# EAGLE design v15 (EAGLE 9.3.0)

## Sheet 1 of 2: Microcontroller & IO
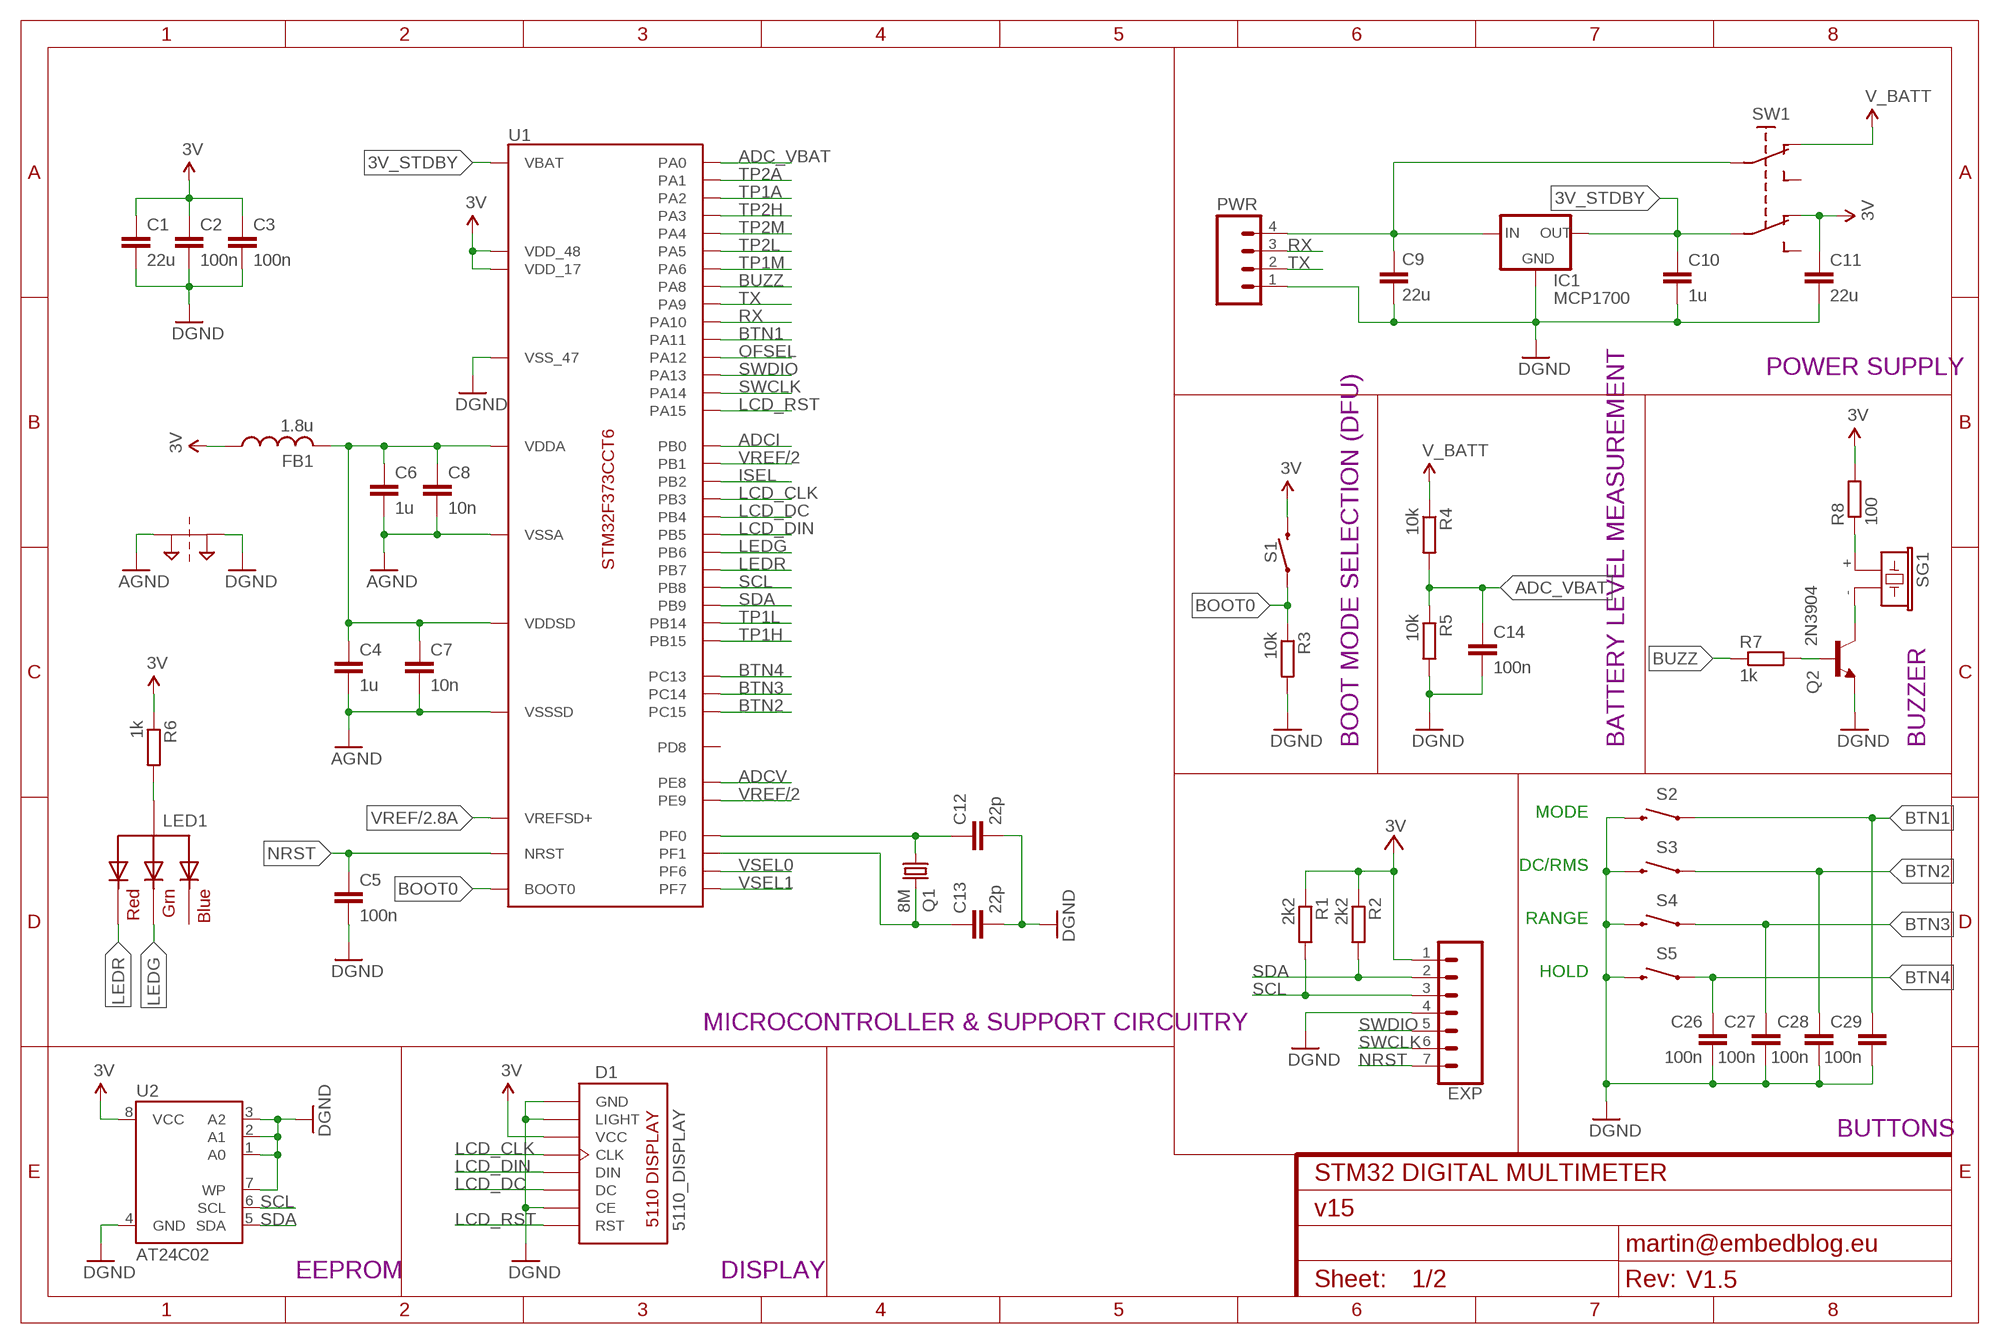
[diagram p0: schematic, sheet 1]
FRAME1 (FRAME-A4L): CNAME: STM32 DIGITAL MULTIMETER; CREVISION: V1.5; DESIGNER: martin@embedblog.eu

### Parts
C1  22u  C-EUC1206  [C1206]
C2  100n  C-EUC1206  [C1206]
C3  100n  C-EUC1206  [C1206]
C4  1u  C-EUC1206  [C1206]
C5  100n  C-EUC1206  [C1206]
C6  1u  C-EUC1206  [C1206]
C7  10n  C-EUC1206  [C1206]
C8  10n  C-EUC1206  [C1206]
C9  22u  C-EUC1206  [C1206]
C10  1u  C-EUC1206  [C1206]
C11  22u  C-EUC1206  [C1206]
C12  22p  C-EUC1206  [C1206]
C13  22p  C-EUC1206  [C1206]
C14  100n  C-EUC1206  [C1206]
C26  100n  C-EUC1206  [C1206]
C27  100n  C-EUC1206  [C1206]
C28  100n  C-EUC1206  [C1206]
C29  100n  C-EUC1206  [C1206]
D1  5110_DISPLAY  [5110_LAYOUT]
EXP  CONN_07  [1X07]
FB1  1.8u  FERRITE-BEADC  [1206]
IC1  MCP1700  XC63FPM  [SOT23]
LED1  RGBLED_CA-5MM  [LED5MMRGB]
PT1  2PT_GND_TIE  [2PT_GND_TIE]
PWR  M04PTH  [1X04@1]
Q1  8M  CRYSTALHC49U-V  [HC49U-V]
Q2  2N3904  2N3904-MMBT  [SOT23]
R1  2k2  R-EU_R1206  [R1206]
R2  2k2  R-EU_R1206  [R1206]
R3  10k  R-EU_R1206  [R1206]
R4  10k  R-EU_R1206  [R1206]
R5  10k  R-EU_R1206  [R1206]
R6  1k  R-EU_R1206  [R1206]
R7  1k  R-EU_R1206  [R1206]
R8  100  R-EU_R1206  [R1206]
S1  MOMENTARY-SWITCH-SPST-PTH-6.0MM  [TACTILE_SWITCH_PTH_6.0MM]
S2  MOMENTARY-SWITCH-SPST-SMD-12MM  [TACTILE_SWITCH_SMD_12MM]
S3  MOMENTARY-SWITCH-SPST-SMD-12MM  [TACTILE_SWITCH_SMD_12MM]
S4  MOMENTARY-SWITCH-SPST-SMD-12MM  [TACTILE_SWITCH_SMD_12MM]
S5  MOMENTARY-SWITCH-SPST-SMD-12MM  [TACTILE_SWITCH_SMD_12MM]
SG1  F/CM12P  [F/CM12P]
SW1  DPDT_SWITCH_SMALL  [DPDT_SMALL]
U1  STM32F373CCT6  [LQFP-48]
U2  AT24C02  24LCXX  [SOIC8]

### Nets
3V: C1.1 C2.1 C3.1 C11.1 D1.VCC EXP.1 FB1.1 R1.1 R2.1 R6.1 R8.2 S1.3 SW1.P$6(NC2) U1.17(VDD_17) U1.48(VDD_48) U2.8(VCC) ; also sheet 2
3V_STDBY: C10.1 IC1.2(OUT) SW1.P$5(I2) U1.1(VBAT)
ADC_VBAT: C14.1 R4.2 R5.1 U1.10(PA0)
ADCI: U1.18(PB0) ; also sheet 2
ADCV: U1.21(PE8) ; also sheet 2
AGND: C4.2 C6.2 C7.2 C8.2 PT1.P$1 U1.8(VSSA) U1.23(VSSSD) ; also sheet 2
BOOT0: R3.1 S1.1 U1.44(BOOT0)
BTN1: C29.1 S2.1 U1.32(PA11)
BTN2: C28.1 S3.1 U1.4(PC15)
BTN3: C27.1 S4.1 U1.3(PC14)
BTN4: C26.1 S5.1 U1.2(PC13)
BUZZ: R7.1 U1.29(PA8)
GND: C1.2 C2.2 C3.2 C5.2 C9.2 C10.2 C11.2 C12.2 C13.2 C14.2 C26.2 C27.2 C28.2 C29.2 D1.CE D1.GND D1.LIGHT EXP.4 IC1.1(GND) PT1.P$2 PWR.1 Q2.2(E) R3.2 R5.2 S2.3 S3.3 S4.3 S5.3 U1.47(VSS_47) U2.1(A0) U2.2(A1) U2.3(A2) U2.4(GND) U2.7(WP) ; supply symbol labelled DGND
ISEL: U1.20(PB2) ; also sheet 2
LCD_CLK: D1.CLK U1.39(PB3)
LCD_DC: D1.DC U1.40(PB4)
LCD_DIN: D1.DIN U1.41(PB5)
LCD_RST: D1.RST U1.38(PA15)
LEDG: LED1.3(GREEN) U1.42(PB6)
LEDR: LED1.1(RED) U1.43(PB7)
N$2: C12.1 Q1.1 U1.5(PF0)
N$8: C4.1 C6.1 C7.1 C8.1 FB1.2 U1.9(VDDA) U1.24(VDDSD)
N$14: C9.1 IC1.3(IN) PWR.4 SW1.P$2(I1)
N$15: LED1.2(VCC) R6.2
N$19: R8.1 SG1.+
N$21: C13.1 Q1.2 U1.6(PF1)
N$36: Q2.3(C) SG1.-
N$37: Q2.1(B) R7.2
NRST: C5.1 EXP.7 U1.7(NRST)
OFSEL: U1.33(PA12) ; also sheet 2
RX: PWR.3 U1.31(PA10)
SCL: EXP.3 R1.2 U1.45(PB8) U2.6(SCL)
SDA: EXP.2 R2.2 U1.46(PB9) U2.5(SDA)
SWCLK: EXP.6 U1.37(PA14)
SWDIO: EXP.5 U1.34(PA13)
TP1A: U1.12(PA2) ; also sheet 2
TP1H: U1.27(PB15) ; also sheet 2
TP1L: U1.26(PB14) ; also sheet 2
TP1M: U1.16(PA6) ; also sheet 2
TP2A: U1.11(PA1) ; also sheet 2
TP2H: U1.13(PA3) ; also sheet 2
TP2L: U1.15(PA5) ; also sheet 2
TP2M: U1.14(PA4) ; also sheet 2
TX: PWR.2 U1.30(PA9)
V_BATT: R4.1 SW1.P$1(NC1)
VREF: U1.25(VREFSD+) ; also sheet 2
VREF/2: U1.19(PB1) U1.22(PE9) ; also sheet 2
VSEL0: U1.35(PF6) ; also sheet 2
VSEL1: U1.36(PF7) ; also sheet 2
Unconnected: LED1.4(BLUE) SW1.P$3(NO1) SW1.P$4(NO2) U1.28(PD8)

### Notes on the sheet
- POWER SUPPLY
- BOOT MODE SELECTION (DFU) | BATTERY LEVEL MEASUREMENT | BUZZER
- MODE
- DC/RMS
- RANGE
- HOLD
- MICROCONTROLLER & SUPPORT CIRCUITRY
- BUTTONS
- EEPROM | DISPLAY

## Sheet 2 of 2: Analog Front End
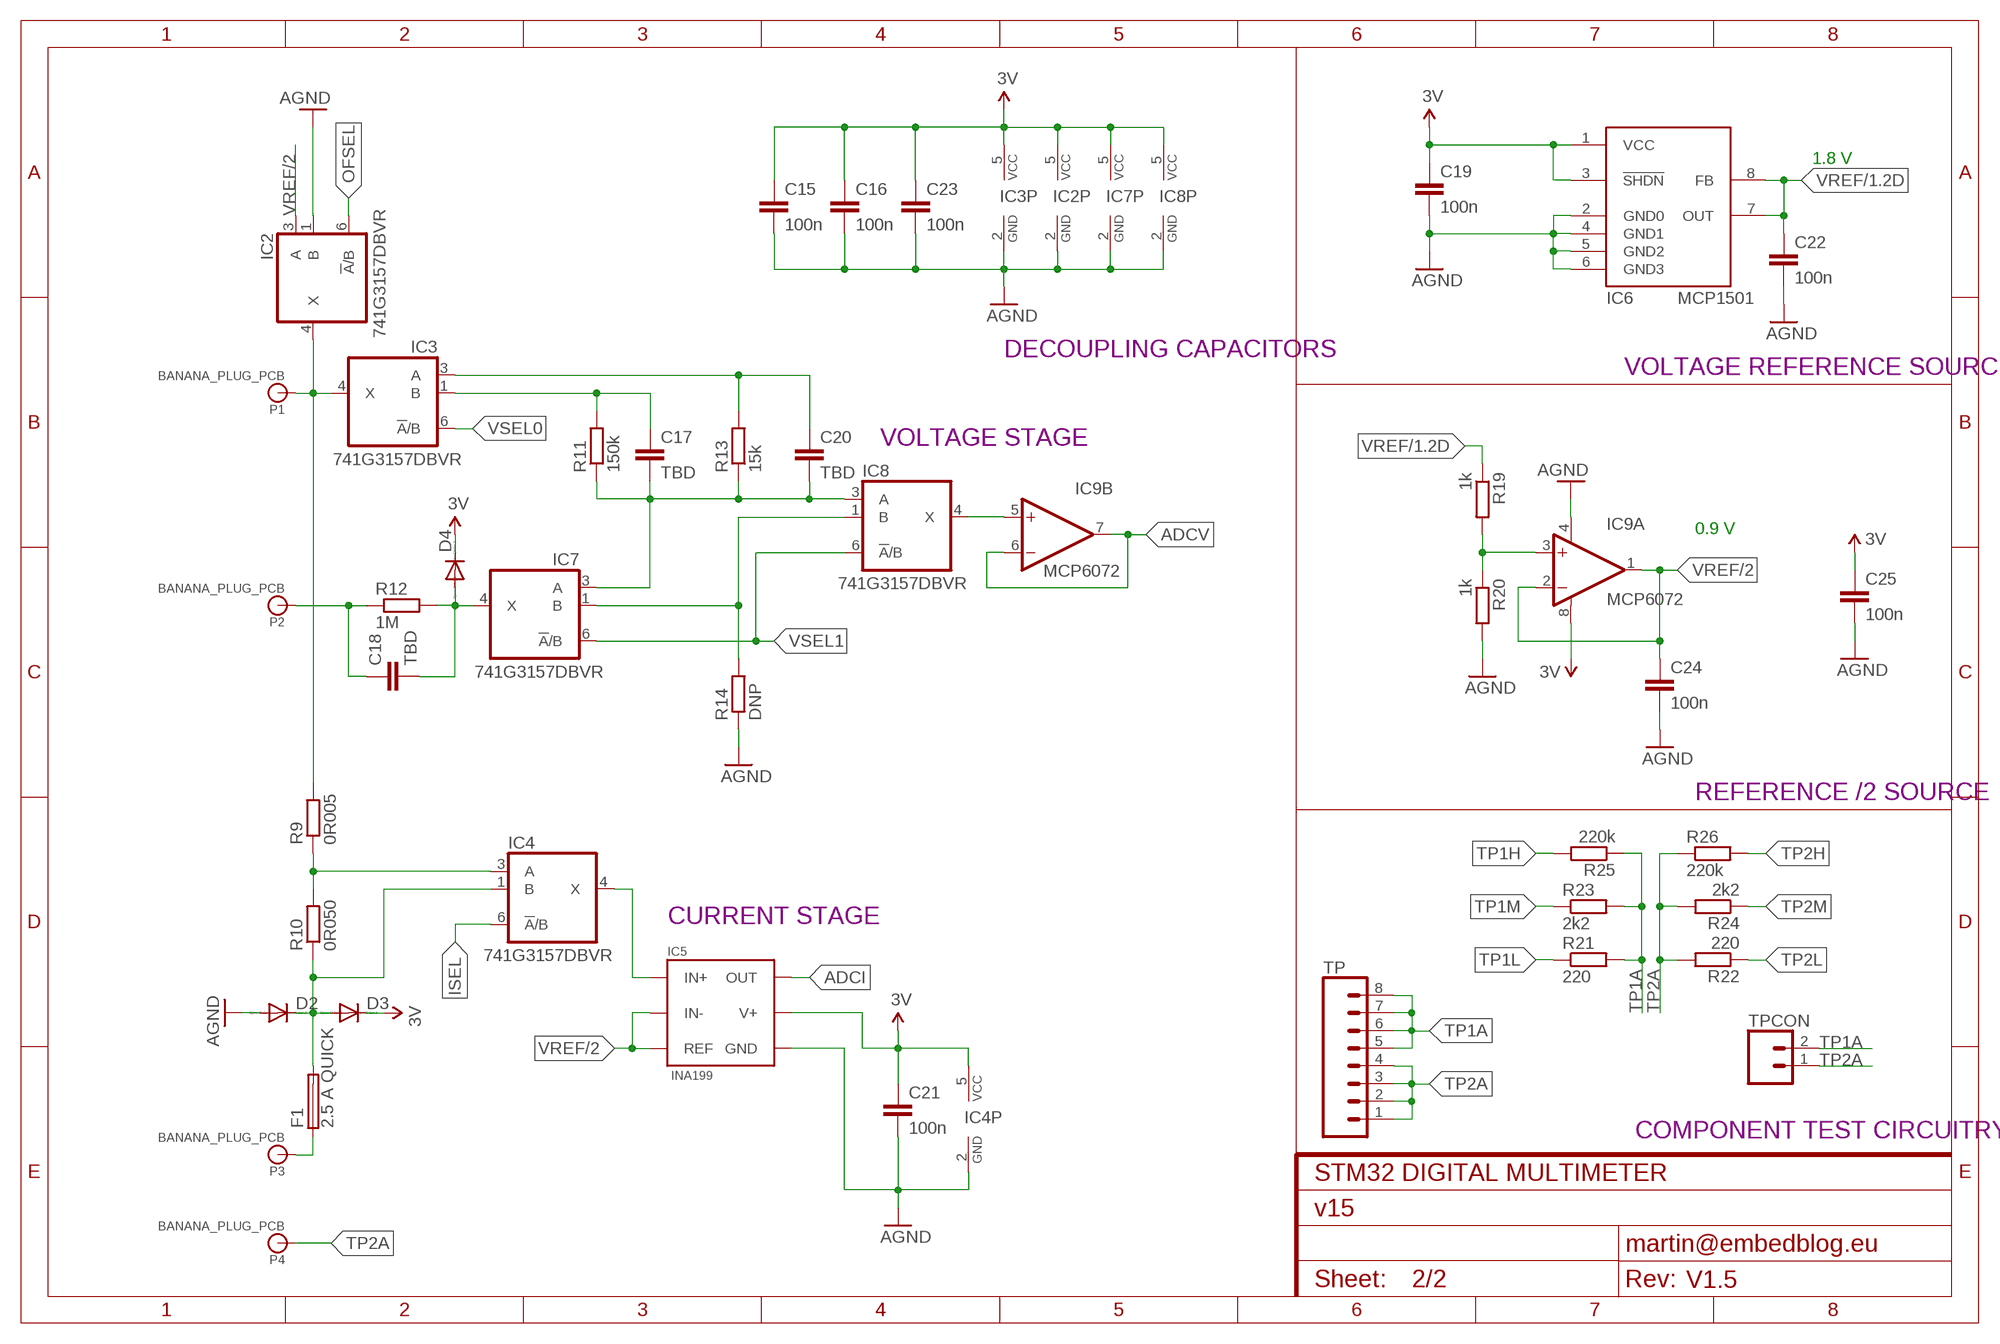
[diagram p1: schematic, sheet 2]
FRAME2 (FRAME-A4L): CNAME: STM32 DIGITAL MULTIMETER; CREVISION: V1.5; DESIGNER: martin@embedblog.eu

### Parts
C15  100n  CAP1206  [1206]
C16  100n  CAP1206  [1206]
C17  TBD  CAP1206  [1206]
C18  TBD  CAP1206  [1206]
C19  100n  C-EUC1206  [C1206]
C20  TBD  CAP1206  [1206]
C21  100n  CAP1206  [1206]
C22  100n  C-EUC1206  [C1206]
C23  100n  CAP1206  [1206]
C24  100n  C-EUC1206  [C1206]
C25  100n  C-EUC1206  [C1206]
D2  DIODE-MINIMELF  [MINIMELF]
D3  DIODE-MINIMELF  [MINIMELF]
D4  DIODE-MINIMELF  [MINIMELF]
F1  2.5 A QUICK  FUSESHK20L  [SHK20L]
IC2  741G3157DBVR  [DBV_R-PDSO-G6]
IC3  741G3157DBVR  [DBV_R-PDSO-G6]
IC4  741G3157DBVR  [DBV_R-PDSO-G6]
IC5  INA199  [SC70-6]
IC6  MCP1501  [SO08]
IC7  741G3157DBVR  [DBV_R-PDSO-G6]
IC8  741G3157DBVR  [DBV_R-PDSO-G6]
IC9  MCP6072  OPAMP-DUALU  [SO08]
P1  BANANA_PLUG_PCB  [BANANA_6MMHOLE]
P2  BANANA_PLUG_PCB  [BANANA_6MMHOLE]
P3  BANANA_PLUG_PCB  [BANANA_6MMHOLE]
P4  BANANA_PLUG_PCB  [BANANA_6MMHOLE]
R9  0R005  R-EU_R1206  [R1206]
R10  0R050  R-EU_R1206  [R1206]
R11  150k  R-EU_R1206  [R1206]
R12  1M  R-EU_R1206  [R1206]
R13  15k  R-EU_R1206  [R1206]
R14  DNP  R-EU_R1206  [R1206]
R19  1k  R-EU_R1206  [R1206]
R20  1k  R-EU_R1206  [R1206]
R21  220  R-EU_R1206  [R1206]
R22  220  R-EU_R1206  [R1206]
R23  2k2  R-EU_R1206  [R1206]
R24  2k2  R-EU_R1206  [R1206]
R25  220k  R-EU_R1206  [R1206]
R26  220k  R-EU_R1206  [R1206]
TP  CONN_08SMD-STRAIGHT-FEMALE  [1X08_SMD]
TPCON  CONN_02  [1X02]

### Nets
3V: C15.1 C16.1 C19.1 C21.1 C23.1 C25.1 D3.C D4.C IC2.5(VCC) IC3.5(VCC) IC4.5(VCC) IC5.3(V+) IC6.1(VCC) IC6.3(!SHDN) IC7.5(VCC) IC8.5(VCC) IC9.8(A:V+) ; also sheet 1
ADCI: IC5.6(OUT) ; also sheet 1
ADCV: IC9.6(B:-IN) IC9.7(B:OUT) ; also sheet 1
AGND: C15.2 C16.2 C19.2 C21.2 C22.2 C23.2 C24.2 C25.2 D2.A IC2.1(B) IC2.2(GND) IC3.2(GND) IC4.2(GND) IC5.2(GND) IC6.2(GND0) IC6.4(GND1) IC6.5(GND2) IC6.6(GND3) IC7.2(GND) IC8.2(GND) IC9.4(A:V-) R14.1 R20.2 ; also sheet 1
COM: IC2.4(X) IC3.4(X) P1.P$1 R9.2
ISEL: IC4.6(!A!/B) ; also sheet 1
N$1: C18.1 P2.P$1 R12.1
N$3: C17.1 IC3.1(B) R11.2
N$4: C20.1 IC3.3(A) R13.2
N$5: C18.2 D4.A IC7.4(X) R12.2
N$7: IC4.3(A) R9.1 R10.2
N$9: C17.2 C20.2 IC7.3(A) IC8.3(A) R11.1 R13.1
N$10: D2.C D3.A F1.2A IC4.1(B) R10.1
N$12: IC8.4(X) IC9.5(B:+IN)
N$13: IC7.1(B) IC8.1(B) R14.2
N$17: IC9.3(A:+IN) R19.2 R20.1
N$18: IC4.4(X) IC5.4(IN+)
N$22: F1.1A P3.P$1
OFSEL: IC2.6(!A!/B) ; also sheet 1
TP1A: R21.2 R23.2 R25.1 TP.5 TP.6 TP.7 TP.8 TPCON.2 ; also sheet 1
TP1H: R25.2 ; also sheet 1
TP1L: R21.1 ; also sheet 1
TP1M: R23.1 ; also sheet 1
TP2A: P4.P$1 R22.2 R24.2 R26.1 TP.1 TP.2 TP.3 TP.4 TPCON.1 ; also sheet 1
TP2H: R26.2 ; also sheet 1
TP2L: R22.1 ; also sheet 1
TP2M: R24.1 ; also sheet 1
VREF: C22.1 IC6.7(OUT) IC6.8(FB) R19.1 ; also sheet 1
VREF/2: C24.1 IC2.3(A) IC5.1(REF) IC5.5(IN-) IC9.1(A:OUT) IC9.2(A:-IN) ; also sheet 1
VSEL0: IC3.6(!A!/B) ; also sheet 1
VSEL1: IC7.6(!A!/B) IC8.6(!A!/B) ; also sheet 1

### Notes on the sheet
- 1.8 V
- DECOUPLING CAPACITORS
- VOLTAGE REFERENCE SOURCE
- VOLTAGE STAGE
- 0.9 V
- REFERENCE /2 SOURCE
- CURRENT STAGE
- COMPONENT TEST CIRCUITRY

## Library data of the parts
C1-C14 C19 C22 C24-C29 = resistor:C-EU: CAPACITOR, European symbol
C15-C18 C20 C21 C23 = SparkFun-Passives:CAP: Capacitor Standard 0603 ceramic capacitor, and 0.1" leaded capacitor.
D1 = custom:5110_DISPLAY
D2-D4 = diode:DIODE-: DIODE
EXP = SparkFun-Connectors:CONN_07: Multi connection point. Often used as Generic Header-pin footprint for 0.1 inch spaced/style header connections On any of the 0.1 inch spaced packages, you can populate with these: Break Away Headers - Straight <https://www.sparkfun.com/products/116> (PRT-00116) Break Away Male Headers - Right Angle <https://www.sparkfun.com/products/553> (PRT-00553) Female Headers <https://www.sparkfun.com/products/115> (PRT-00115) Break Away Headers - Machine Pin <https://www.sparkfun.com/products/117> (PRT-00117) Break Away Female Headers - Swiss Machine Pin <https://www.sparkfun.com/products/743> (PRT-00743) For SCREWTERMINALS and SPRING TERMINALS visit here: Screw Terimnals on SparkFun.com <https://www.sparkfun.com/search/results?term=Screw+Terminals> (5mm/3.5mm/2.54mm spacing) This device is also useful as a general connection point to wire up your design to another part of your project. Our various solder wires solder well into these plated through hole pads. Hook-Up Wire - Assortment (Stranded, 22 AWG) <https://www.sparkfun.com/products/11375> (PRT-11375) Hook-Up Wire - Assortment (Solid Core, 22 AWG) <https://www.sparkfun.com/products/11367> (PRT-11367) View the entire wire category on our website here <https://www.sparkfun.com/categories/141> Special notes: Molex polarized connector foot print use with SKU : PRT-08231 with associated crimp pins and housings. 1MM SMD Version SKU: PRT-10208 NOTES ON THE VARIANTS LOCK and LOCK_LONGPADS... This footprint was designed to help hold the alignment of a through-hole component (i.e. 6-pin header) while soldering it into place. You may notice that each hole has been shifted either up or down by 0.005 of an inch from it's more standard position (which is a perfectly straight line). This slight alteration caused the pins (the squares in the middle) to touch the edges of the holes. Because they are alternating, it causes a "brace" to hold the component in place. 0.005 has proven to be the perfect amount of "off-center" position when using our standard breakaway headers. Although looks a little odd when you look at the bare footprint, once you have a header in there, the alteration is very hard to notice. Also,if you push a header all the way into place, it is covered up entirely on the bottom side.
F1 = fuse:FUSE: Fuse; OC_FARNELL: unknown; OC_NEWARK: unknown
FB1 = m-pad-2.1:FERRITE-BEAD: Ferrite beads in various packages
IC1 = v-reg:XC63FP: Positiv Voltage Regulators www.torex.co.jp/english/product/pro02/pdf/0201_xc62fp.pdf
IC2-IC4 IC7 IC8 = 74xx-little-de:74*1G3157: Single-Pole, Double-Throw Analog Switch Source: http://focus.ti.com/lit/ds/symlink/sn74lvc1g3157.pdf
IC5 = custom:INA199
IC6 = custom:MCP1501
IC9 = SparkFun-AnalogIC:OPAMP-DUAL: Generic op-amp footprint
LED1 = adafruit:RGBLED_CA: RGB LED, common-anode 5MM Staggered pins 5mm Piranha package http://www.ladyada.net/library/pcb/eaglelibrary.html
P1-P4 = custom:BANANA_PLUG_PCB
PT1 = SparkFun-Passives:2PT_GND_TIE: Package for connecting two ground nets in one place.
PWR = SparkFun-Connectors:M04: Header 4 Standard 4-pin 0.1" header. Use with straight break away headers (SKU : PRT-00116), right angle break away headers (PRT-00553), swiss pins (PRT-00743), machine pins (PRT-00117), and female headers (PRT-00115). Molex polarized connector foot print use with SKU : PRT-08231 with associated crimp pins and housings. 1MM SMD Version SKU: PRT-10208; PROD_ID: CONN-09696
Q1 = crystal:CRYSTAL: CRYSTAL; OC_FARNELL: 1666969; OC_NEWARK: unknown
Q2 = m-pad-2.1:2N3904: NPN TRANSISTOR
R1-R14 R19-R26 = resistor:R-EU_: RESISTOR, European symbol
S1 = SparkFun-Switches:MOMENTARY-SWITCH-SPST: Momentary Switch (Pushbutton) - SPST Normally-open (NO) SPST momentary switches (buttons, pushbuttons). Variants PTH-12MM - 12mm square, through-hole Momentary Pushbutton Switch - 12mm Square <https://www.sparkfun.com/products/9190> (COM-09190) PTH-6.0MM, PTH-6.0MM-KIT - 6.0mm square, through-hole Mini Pushbutton Switch <https://www.sparkfun.com/products/97> (COM-00097) KIT package intended for soldering kit's - only one side of pads' copper is exposed. PTH-RIGHT-ANGLE-KIT - Right-angle, through-hole Right Angle Tactile Button <https://www.sparkfun.com/products/10791> - Used on SparkFun BigTime Watch Kit <https://www.sparkfun.com/products/11734> SMD-12MM - 12mm square, surface-mount Tactile Button - SMD (12mm) <https://www.sparkfun.com/products/12993> (COM-12993) Used on SparkFun PicoBoard <https://www.sparkfun.com/products/11888> SMD-4.5MM - 4.5mm Square Trackball Switch Used on SparkFun Blackberry Trackballer Breakout <https://www.sparkfun.com/products/13169> SMD-4.6MMX2.8MM - 4.60mm x 2.80mm, surface mount Used on SparkFun SAMD21 Mini Breakout <https://www.sparkfun.com/products/13664> SMD-5.2MM, SMD-5.2-REDUNDANT - 5.2mm square, surface-mount Mini Pushbutton Switch - SMD <https://www.sparkfun.com/products/8720> (COM-08720) Used on Arduino Pro Mini <https://www.sparkfun.com/products/11114> REDUNDANT package connects both switch circuits together SMD-6.0X3.5MM - 6.0 x 3.5mm, surface mount Momentary Reset Switch SMD <https://www.sparkfun.com/products/8229> (COM-08229) SMD-6.2MM-TALL - 6.2mm square, surface mount Tactile Button - SMD (6mm) <https://www.sparkfun.com/products/12992> Used on SparkFun Digital Sandbox <https://www.sparkfun.com/products/12651> SMD-RIGHT-ANGLE - Right-angle, surface mount Used on SparkFun Block for Intel® Edison - Arduino <https://www.sparkfun.com/products/13036>; PROD_ID: SWCH-08441; SF_SKU: COM-00097
S2-S5 = SparkFun-Switches:MOMENTARY-SWITCH-SPST: Momentary Switch (Pushbutton) - SPST Normally-open (NO) SPST momentary switches (buttons, pushbuttons). Variants PTH-12MM - 12mm square, through-hole Momentary Pushbutton Switch - 12mm Square <https://www.sparkfun.com/products/9190> (COM-09190) PTH-6.0MM, PTH-6.0MM-KIT - 6.0mm square, through-hole Mini Pushbutton Switch <https://www.sparkfun.com/products/97> (COM-00097) KIT package intended for soldering kit's - only one side of pads' copper is exposed. PTH-RIGHT-ANGLE-KIT - Right-angle, through-hole Right Angle Tactile Button <https://www.sparkfun.com/products/10791> - Used on SparkFun BigTime Watch Kit <https://www.sparkfun.com/products/11734> SMD-12MM - 12mm square, surface-mount Tactile Button - SMD (12mm) <https://www.sparkfun.com/products/12993> (COM-12993) Used on SparkFun PicoBoard <https://www.sparkfun.com/products/11888> SMD-4.5MM - 4.5mm Square Trackball Switch Used on SparkFun Blackberry Trackballer Breakout <https://www.sparkfun.com/products/13169> SMD-4.6MMX2.8MM - 4.60mm x 2.80mm, surface mount Used on SparkFun SAMD21 Mini Breakout <https://www.sparkfun.com/products/13664> SMD-5.2MM, SMD-5.2-REDUNDANT - 5.2mm square, surface-mount Mini Pushbutton Switch - SMD <https://www.sparkfun.com/products/8720> (COM-08720) Used on Arduino Pro Mini <https://www.sparkfun.com/products/11114> REDUNDANT package connects both switch circuits together SMD-6.0X3.5MM - 6.0 x 3.5mm, surface mount Momentary Reset Switch SMD <https://www.sparkfun.com/products/8229> (COM-08229) SMD-6.2MM-TALL - 6.2mm square, surface mount Tactile Button - SMD (6mm) <https://www.sparkfun.com/products/12992> Used on SparkFun Digital Sandbox <https://www.sparkfun.com/products/12651> SMD-RIGHT-ANGLE - Right-angle, surface mount Used on SparkFun Block for Intel® Edison - Arduino <https://www.sparkfun.com/products/13036>; PROD_ID: SWCH-11967; SF_SKU: COM-12993
SG1 = buzzer:F/CM12P: BUZZER Source: Buerklin; OC_FARNELL: unknown; OC_NEWARK: unknown
SW1 = custom:DPDT_SWITCH_SMALL
TP = SparkFun-Connectors:CONN_08: Multi connection point. Often used as Generic Header-pin footprint for 0.1 inch spaced/style header connections On any of the 0.1 inch spaced packages, you can populate with these: Break Away Headers - Straight <https://www.sparkfun.com/products/116> (PRT-00116) Break Away Male Headers - Right Angle <https://www.sparkfun.com/products/553> (PRT-00553) Female Headers <https://www.sparkfun.com/products/115> (PRT-00115) Break Away Headers - Machine Pin <https://www.sparkfun.com/products/117> (PRT-00117) Break Away Female Headers - Swiss Machine Pin <https://www.sparkfun.com/products/743> (PRT-00743) Arduino Stackable Header - 8 Pin <https://www.sparkfun.com/products/9279> (PRT-09279) For SCREWTERMINALS and SPRING TERMINALS visit here: Screw Terimnals on SparkFun.com <https://www.sparkfun.com/search/results?term=Screw+Terminals> (5mm/3.5mm/2.54mm spacing) This device is also useful as a general connection point to wire up your design to another part of your project. Our various solder wires solder well into these plated through hole pads. Hook-Up Wire - Assortment (Stranded, 22 AWG) <https://www.sparkfun.com/products/11375> (PRT-11375) Hook-Up Wire - Assortment (Solid Core, 22 AWG) <https://www.sparkfun.com/products/11367> (PRT-11367) View the entire wire category on our website here <https://www.sparkfun.com/categories/141> Special notes: Molex polarized connector foot print use with SKU : PRT-08231 with associated crimp pins and housings. 1MM SMD Version SKU: PRT-10208 NOTES ON THE VARIANTS LOCK and LOCK_LONGPADS... This footprint was designed to help hold the alignment of a through-hole component (i.e. 6-pin header) while soldering it into place. You may notice that each hole has been shifted either up or down by 0.005 of an inch from it's more standard position (which is a perfectly straight line). This slight alteration caused the pins (the squares in the middle) to touch the edges of the holes. Because they are alternating, it causes a "brace" to hold the component in place. 0.005 has proven to be the perfect amount of "off-center" position when using our standard breakaway headers. Although looks a little odd when you look at the bare footprint, once you have a header in there, the alteration is very hard to notice. Also,if you push a header all the way into place, it is covered up entirely on the bottom side.; PROD_ID: CONN-10204; SF_ID: PRT-11543
TPCON = SparkFun-Connectors:CONN_02: Multi connection point. Often used as Generic Header-pin footprint for 0.1 inch spaced/style header connections On any of the 0.1 inch spaced packages, you can populate with these: Break Away Headers - Straight <https://www.sparkfun.com/products/116> (PRT-00116) Break Away Male Headers - Right Angle <https://www.sparkfun.com/products/553> (PRT-00553) Female Headers <https://www.sparkfun.com/products/115> (PRT-00115) Break Away Headers - Machine Pin <https://www.sparkfun.com/products/117> (PRT-00117) Break Away Female Headers - Swiss Machine Pin <https://www.sparkfun.com/products/743> (PRT-00743) For SCREWTERMINALS and SPRING TERMINALS visit here: Screw Terimnals on SparkFun.com <https://www.sparkfun.com/search/results?term=Screw+Terminals> (5mm/3.5mm/2.54mm spacing) This device is also useful as a general connection point to wire up your design to another part of your project. Our various solder wires solder well into these plated through hole pads. Hook-Up Wire - Assortment (Stranded, 22 AWG) <https://www.sparkfun.com/products/11375> (PRT-11375) Hook-Up Wire - Assortment (Solid Core, 22 AWG) <https://www.sparkfun.com/products/11367> (PRT-11367) View the entire wire category on our website here <https://www.sparkfun.com/categories/141> Special notes: Molex polarized connector foot print use with: PRT-08233 with associated crimp pins and housings. 2.54_SCREWTERM for use with PRT-10571. 3.5mm Screw Terminal footprints for PRT-08084 5mm Screw Terminal footprints for use with PRT-08432
U1 = custom:STM32F373CCT6
U2 = m-pad-2.1:24LCXX: Serial I2C bus eeprom

## Board
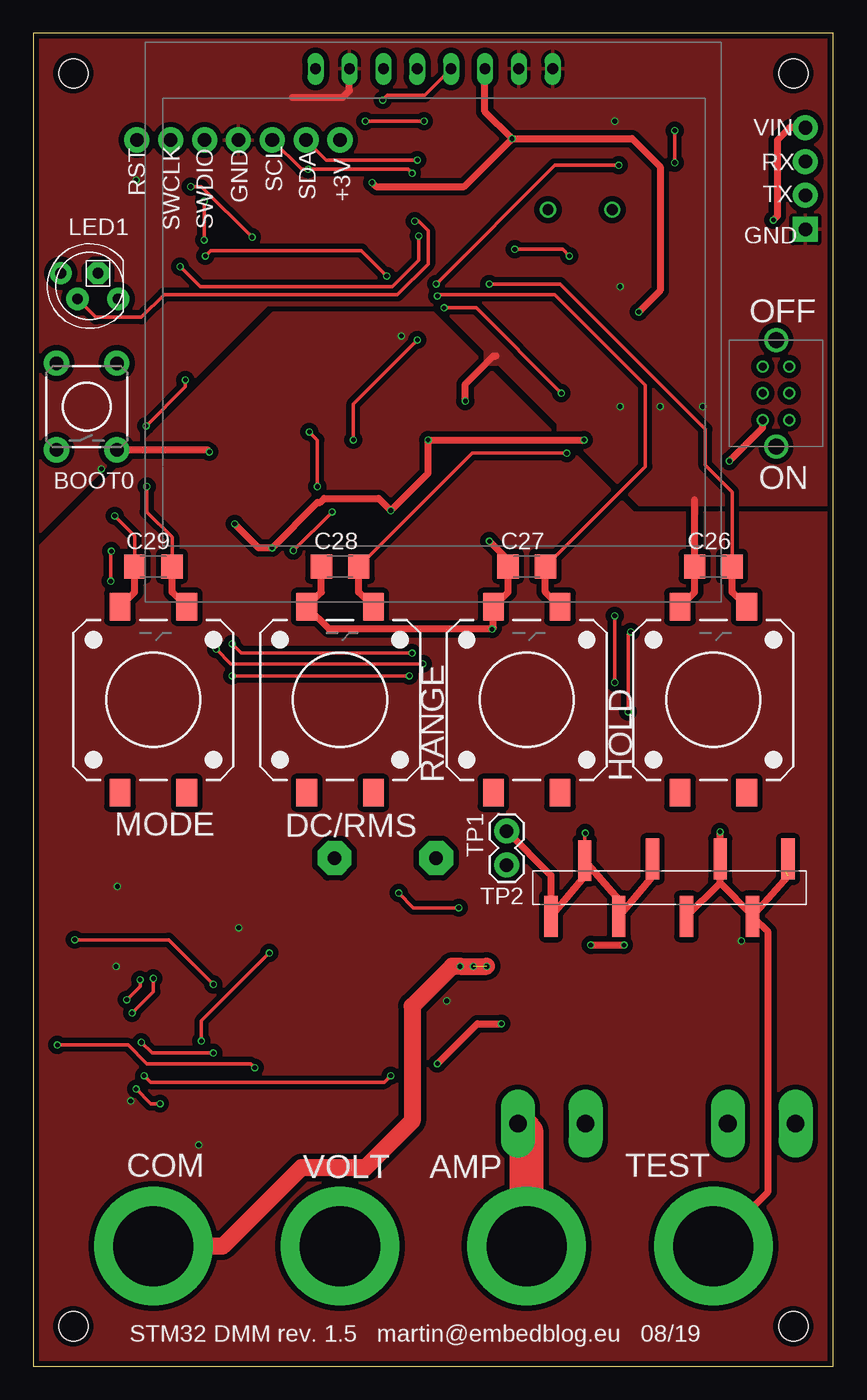
[diagram p2: board, top side]
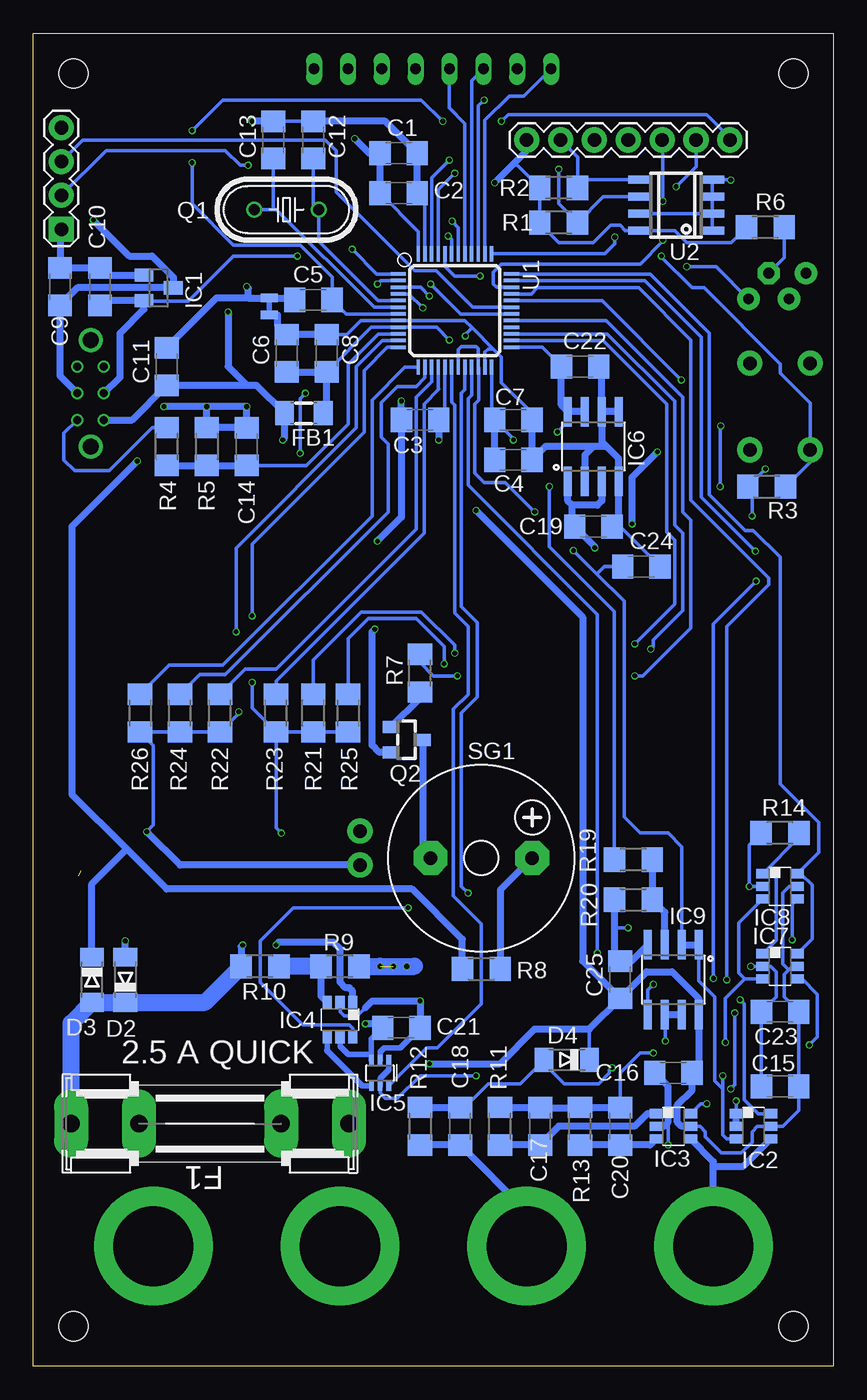
[diagram p3: board, bottom side, seen from below]

Size 60 x 100 mm. Coordinates in mm from the lower left corner, seen from the top.
Outline: 0,0 60,0 60,100 0,100 0,0
Copper layers (1*16): Top 0.035mm / dielectric 1.2mm / Bottom 0.035mm
Design rules "JLCPCB": minimum track width 5mil, minimum drill 0.3mm, track to track 5mil, track to pad 5mil, pad to pad 5mil, via to via 5mil, smd to smd 5mil, copper to edge 0.2mm, drill to drill 6mil, minimum pad ring 3mil, minimum via ring 3mil, stop-mask expansion 4mil, vias tented up to drill 0mil, thermal gap 10mil
Holes 2.2 mm at 3,3 57,3 57,97 3,97

### Footprints (pad centres in the part's own frame; a part is rotated, then mirrored left to right if it is on the bottom)
C1206 = smd 1.6 x 1.8: 1 -1.4,0; 2 1.4,0
1206 = smd 1.6 x 1.8: 1 -1.4,0; 2 1.4,0
5110_LAYOUT = drill 0.8 long: CE 0,-5.08; CLK 0,2.54; DC 0,-2.54; DIN 0,0; GND 0,10.16; LIGHT 0,7.62; RST 0,-7.62; VCC 0,5.08
MINIMELF = smd 1.4 x 1.8: A 1.7,0; C -1.7,0
1X07 = drill 1.016 pad 1.88: 1 0,0; 2 2.54,0; 3 5.08,0; 4 7.62,0; 5 10.16,0; 6 12.7,0; 7 15.24,0
SHK20L = drill 1.321 pad 2.54 long: 1A -10.414,0; 1B -5.334,0; 2A 10.414,0; 2B 5.334,0
1206' = smd 1.4 x 1.8: 1 -1.45,0; 2 1.45,0
SOT23 = smd 1 x 1.4: 1 -0.95,-1.1; 2 0.95,-1.1; 3 0,1.1
DBV_R-PDSO-G6 = smd 0.69 x 0.99: 1 -0.95,-1.29; 2 0,-1.29; 3 0.95,-1.29; 4 0.95,1.3; 5 0,1.3; 6 -0.95,1.3
SC70-6 = smd 0.35 x 0.8: 1 -0.65,-0.95; 2 0,-0.95; 3 0.65,-0.95; 4 0.65,0.95; 5 0,0.95; 6 -0.65,0.95
SO08 = smd 0.61 x 2.21: 1 -1.905,-2.616; 2 -0.635,-2.616; 3 0.635,-2.616; 4 1.905,-2.616; 5 1.905,2.616; 6 0.635,2.616; 7 -0.635,2.616; 8 -1.905,2.616
LED5MMRGB = drill 0.8 pad 1.676: 1 -2.159,0.968; 3 0.889,0.968; 4 2.159,-0.968 | drill 0.8 pad 1.676 octagon: 2 -0.635,-0.968
BANANA_6MMHOLE = drill 6.02 pad 8.89: P$1 0,0
2PT_GND_TIE = smd 1.27 x 0.635: P$1 0,0.635; P$2 0,-0.635
1X04@1 = drill 1.016 pad 1.88 square: 1 0,0 | drill 1.016 pad 1.88: 2 2.54,0; 3 5.08,0; 4 7.62,0
HC49U-V = drill 0.813: 1 -2.413,0; 2 2.413,0
SOT23' = smd 0.9 x 1.2: 1 -0.95,-1.2; 2 0.95,-1.2; 3 0,1.2
R1206 = smd 1.6 x 1.803: 1 -1.422,0; 2 1.422,0
TACTILE_SWITCH_PTH_6.0MM = drill 1.016 pad 1.88: 1 -3.251,2.261; 2 3.251,2.261; 3 -3.251,-2.261; 4 3.251,-2.261
TACTILE_SWITCH_SMD_12MM = smd 2.032 x 1.55: 1 6.975,-2.5; 2 -6.975,-2.5; 3 6.975,2.5; 4 -6.975,2.5
F/CM12P = drill 1.016 pad 2.54 octagon: + 3.81,0; - -3.81,0
DPDT_SMALL = drill 0.6: P$1 0,0; P$2 2,0; P$3 4,0; P$4 4,2; P$5 2,2; P$6 0,2 | drill 1.2: P$7 -2,1; P$8 6,1
1X08_SMD = smd 1 x 3.048: 1 0,2.158; 2 -2.667,-2.158; 3 -5.08,2.158; 4 -7.62,-2.158; 5 -10.16,2.158; 6 -12.7,-2.158; 7 -15.24,2.031; 8 -17.78,-2.158
1X02 = drill 1.016 pad 1.88: 1 0,0; 2 2.54,0
LQFP-48 = smd 0.254 x 1.143: 1 -2.75,-4.25; 2 -2.25,-4.25; 3 -1.75,-4.25; 4 -1.25,-4.25; 5 -0.75,-4.25; 6 -0.25,-4.25; 7 0.25,-4.25; 8 0.75,-4.25; 9 1.25,-4.25; 10 1.75,-4.25; 11 2.25,-4.25; 12 2.75,-4.25; 25 2.75,4.25; 26 2.25,4.25; 27 1.75,4.25; 28 1.25,4.25; 29 0.75,4.25; 30 0.25,4.25; 31 -0.25,4.25; 32 -0.75,4.25; 33 -1.25,4.25; 34 -1.75,4.25; 35 -2.25,4.25; 36 -2.75,4.25 | smd 1.143 x 0.254: 13 4.25,-2.75; 14 4.25,-2.25; 15 4.25,-1.75; 16 4.25,-1.25; 17 4.25,-0.75; 18 4.25,-0.25; 19 4.25,0.25; 20 4.25,0.75; 21 4.25,1.25; 22 4.25,1.75; 23 4.25,2.25; 24 4.25,2.75; 37 -4.25,2.75; 38 -4.25,2.25; 39 -4.25,1.75; 40 -4.25,1.25; 41 -4.25,0.75; 42 -4.25,0.25; 43 -4.25,-0.25; 44 -4.25,-0.75; 45 -4.25,-1.25; 46 -4.25,-1.75; 47 -4.25,-2.25; 48 -4.25,-2.75
SOIC8 = smd 0.6 x 1.8: 1 -1.905,-2.7; 2 -0.635,-2.7; 3 0.635,-2.7; 4 1.905,-2.7; 5 1.905,2.7; 6 0.635,2.7; 7 -0.635,2.7; 8 -1.905,2.7

### Placement (x,y rotation side)
C1  32.6,91 0 bottom
C2  32.6,88 0 bottom
C3  31,71 180 bottom
C4  24,68 0 bottom
C5  39,80 180 bottom
C6  41,76 90 bottom
C7  24,71 0 bottom
C8  38,76 90 bottom
C9  58,81 90 bottom
C10  55,81 90 bottom
C11  50,75 90 bottom
C12  39,92 90 bottom
C13  42,92 90 bottom
C14  44,69 90 bottom
C15  4,21 180 bottom
C16  12,22 180 bottom
C17  22,18 90 bottom
C18  28,18 90 bottom
C19  18,63 0 bottom
C20  16,18 90 bottom
C21  32.4,25.4 0 bottom
C22  19,75 0 bottom
C23  4,26.6 180 bottom
C24  14.4,60 0 bottom
C25  16,29 90 bottom
C26  51,60 180 top
C27  37,60 180 top
C28  23,60 180 top
C29  9,60 180 top
D1  28.79,97.34 270 top
D2  53.1,29 90 bottom
D3  55.6,29 270 bottom
D4  20,23 180 bottom
EXP  23,92 0 bottom
F1  46.75,18.2 180 bottom
FB1  1.8u  [1206']  39.71,71.49 0 bottom
IC1  50.6,80.9 270 bottom
IC2  6,18 270 bottom
IC3  12,18 270 bottom
IC4  37,26 180 bottom
IC5  34,22 180 bottom
IC6  18,69 0 bottom
IC7  4,30 270 bottom
IC8  4,36 270 bottom
IC9  12,29 180 bottom
LED1  4.21,81.04 180 top
P1  9,9 0 top
P2  23,9 0 top
P3  37,9 0 top
P4  51,9 0 top
PT1  42.3,79.5 180 bottom
PWR  57.9,85.3 90 bottom
Q1  41.01,86.77 180 bottom
Q2  2N3904  [SOT23']  32,47 270 bottom
R1  20.6,85.8 0 bottom
R2  20.6,88.4 0 bottom
R3  5,66 180 bottom
R4  50,69 270 bottom
R5  47,69 90 bottom
R6  5.1,85.44 0 bottom
R7  31,52 270 bottom
R8  26.4,29.81 180 bottom
R9  37,30 0 bottom
R10  43,30 0 bottom
R11  25,18 270 bottom
R12  31,18 90 bottom
R13  19,18 270 bottom
R14  4,40 0 bottom
R19  15,38 0 bottom
R20  15,35 180 bottom
R21  39,49 270 bottom
R22  46,49 270 bottom
R23  41.8,49 270 bottom
R24  49,49 270 bottom
R25  36.4,49 90 bottom
R26  52,49 90 bottom
S1  4,72 90 top
S2  9,50 90 top
S3  23,50 90 top
S4  37,50 90 top
S5  51,50 90 top
SG1  26.4,38.12 0 bottom
SW1  56.7,71 90 top
TP  56.6,35.9 0 top
TPCON  35.5,37.6 90 top
U1  28.38,79.2 270 bottom
U2  11.8,87.1 90 bottom

### Tracks (layer width: path | path; a pad name or v marks a point on that pad's centre or on a via)
3V  (via drill 0.35)
  Top 0.508: v35.9,92.1 33.87,94.13 D1.VCC | v25.4,88.8 25.7,88.5 32.3,88.5 v35.9,92.1 | v35.9,92.1 44.9,92.1 47,90 47,80.7 v45.4,79.1 | v15.1,63.2 16.9,61.4 v17.9,61.4 21.3,64.8 21.5,64.8 21.8,65.1 25.9,65.1 v26.8,64.2 29.6,67 v29.6,69.5 v41.3,69.5 | v13.2,68.6 13.05,68.75 S1.3 | v30.3,22.7 33.3,25.7 v35.1,25.7 | v52.2,67.9 54.7,70.4 SW1.P$6
  Bottom 0.254: U1.17 29.13,71.47 C3.1 | U1.48 31.13,85.13 C2.1 | IC3.5 10,18 9.6,17.6 9.6,17.2 8.4,16 6.9,16 6.1,16.8 6.1,17.6 5.7,18 IC2.5 3.8,18 2.6,19.2 C15.1 C23.1 3.7,27.7 3.7,29.4 3.35,29.75 | 24.1,90.1 23.72,90.1 R2.1 R1.1 22.02,85.72 20.6,84.3 18,84.3 16.7,85.6 16,85.6 15.6,85.19 U2.8 11.89,85.19 11,84.3 7.66,84.3 R6.1 | 3.35,29.75 3.1,30 IC7.5 | IC8.5 3.3,36 3.8,35.5 3.8,30.2 3.35,29.75 | D4.C 18.3,25.3
  Bottom 0.406: IC5.3 34.65,23.4 | 34.65,23.4 34.65,24.55 C21.1 | IC4.5 37,24 36.4,23.4 34.65,23.4
  Bottom 0.508: IC6.3 17.36,64.94 17.7,64.6 19.6,64.6 | IC6.1 19.91,64.91 19.6,64.6 | 19.6,64.6 19.6,63.2 C19.1 17.9,61.5 v17.9,61.4 | C2.1 C1.1 34.8,91 v35.9,92.1 | SW1.P$6 52.6,71 C11.1 44,73.6 | 44,73.6 43.27,73.6 FB1.1 41.16,69.64 v41.3,69.5 | IC3.5 11.4,18 11.7,18.3 11.7,19.6 10.6,20.7 C16.1 10.1,22.5 IC9.8 10.1,27.59 12.1,29.6 14,29.6 C25.1 | C21.1 34.1,25.7 v35.1,25.7 | v30.3,22.7 25,22.7 22.4,25.3 18.3,25.3 C25.1 | C25.1 18.8,30.4 18.8,56.2 v26.8,64.2 | C3.1 v29.6,69.5 | v45.4,79.1 45.4,75 44,73.6 | v15.1,63.2 15.1,66.7 v13.2,68.6 | 53,38.8 50,35.8 31.6,35.8 27.82,32.02 R8.2 | 53,38.8 57.1,42.9 57.1,63 v52.2,67.9 | EXP.1 23,91.2 24.1,90.1 v25.4,88.8 | D3.C 55.6,36.2 53,38.8
3V_STDBY  (via drill 0.35)
  Top 0.254: v36.1,83.8 39.7,83.8 v40.2,83.3
  Bottom 0.254: U1.1 34.25,81.95 v36.1,83.8 | v40.2,83.3 45,83.3 48.4,79.9 51.65,79.9 IC1.2
  Bottom 0.508: C10.1 54.65,79.95 IC1.2 51.7,79.3 53.5,77.5 53.5,74.2 SW1.P$5
ADC_VBAT
  Bottom 0.254: U1.10 34.15,77.45 36.4,75.2 36.4,70.7 39.52,67.58 44.02,67.58
  Bottom 0.508: R4.2 R5.1 44.02,67.58 C14.1
ADCI
  Bottom 0.254: U1.18 28.63,72.33 28.4,72.1 28.4,56.5 27.4,55.5 27.4,50.4 28.5,49.3 28.5,35.3 26.4,33.2 26.4,27.2 29.7,23.9 30.5,23.9 IC5.6
ADCV  (via drill 0.35)
  Top 0.254: v17.7,31 12.6,25.9 v12.6,24.4
  Bottom 0.254: U1.21 27.13,72.87 27.4,72.6 27.4,66.1 17.7,56.4 v17.7,31 | v12.6,24.4 12.6,26.35 IC9.6
  Bottom 0.508: IC9.6 IC9.7
AGND  (via drill 0.35)
  Bottom 0.254: IC4.2 37,26.6 36.7,26.3 35.7,26.3 35.1,26.9 | C8.2 36.5,77.4 35.45,78.45 U1.8 27.65,78.45 27.1,77.9 | U1.23 26.13,76.07 25.9,76.3 25.5,76.3 | C7.2 22.6,71.5 24.9,73.8 24.9,75.7 25.5,76.3 | 16.42,33 16.32,32.9 v15.4,32.9 | IC2.1 v7.29,19.89 v7.3,19.9 | C24.2 16,63 C19.2 | 27.1,77.9 25.5,76.3 | 27.1,77.9 27.6,77.4 v27.6,77.3 | PT1.P$1 41.69,78.86 | v6.2,30 IC7.2 4.7,30 4.3,29.6 4.3,27.7 C23.2 C15.2 | IC8.2 v6.3,36 6.3,39.12 R14.1 | 12.39,18.31 12.39,16.61 v12.4,16.6
  Bottom 0.406: IC5.2 34,23.6 33.7,23.9 32.5,23.9 C21.2
  Bottom 0.508: C21.2 v31,27.4 34.6,27.4 35.1,26.9 | IC6.5 IC6.6 | IC6.6 17.36,74.77 C22.2 | 17,69 16.09,68.09 IC6.4 16.09,63.51 C19.2 | 17,69 18,69 | 18,69 18.64,68.36 IC6.2 | C7.2 C4.2 21.6,69 18,69 | IC6.6 17.36,69.36 17,69 | C8.2 C6.2 41.69,78.09 41.69,78.86 | IC3.2 12.7,18 12.39,18.31 12.39,20.99 C16.2 | IC2.2 IC2.1 | IC9.4 15.12,30.4 C25.2 16.42,30.82 16.42,33 R20.2 | D2.A v53.1,31.9
  pour Top (isolate 0.406): 0,0 60,0 60,64 45,64 30,79 18,79 0,61 0,60
BOOT0  (via drill 0.35)
  Top 0.254: v12.9,83.3 13.3,83.7 24.6,83.7 v26.5,81.8
  Bottom 0.254: R3.1 1.74,67.84 S1.1 1.74,72.24 4,74.5 4,75.2 9.7,80.9 10.6,80.9 12.9,83.2 v12.9,83.3 | U1.44 29.13,82.53 28.4,81.8 v26.5,81.8
BTN1  (via drill 0.35)
  Top 0.254: v11.4,74 11.4,73.5 v8.45,70.55 | C29.1 10.4,62.2 8.5,64.1 v8.5,66
  Top 0.508: S2.1 10.4,58.08 C29.1
  Bottom 0.254: U1.32 17.35,79.95 v11.4,74 | v8.5,66 8.5,70.5 v8.45,70.55
BTN2  (via drill 0.35)
  Top 0.254: C28.1 32.9,68.5 v40,68.5 | v39.6,73 33.2,79.4 v30.8,79.4
  Top 0.508: S3.1 24.4,58.08 C28.1
  Bottom 0.254: v40,68.5 40,72.6 v39.6,73 | v30.8,79.4 31.85,80.45 U1.4
BTN3  (via drill 0.35)
  Top 0.254: C27.1 45.9,67.5 45.9,73.6 39.1,80.4 30.4,80.4 v30.3,80.3
  Top 0.508: S4.1 38.4,58.08 C27.1
  Bottom 0.254: v30.3,80.3 30.95,80.95 U1.3
BTN4  (via drill 0.35)
  Top 0.254: C26.1 52.4,65.6 50.4,67.6 50.4,70.3 39.5,81.2 v34.2,81.2
  Top 0.508: S5.1 52.4,58.08 C26.1
  Bottom 0.254: v34.2,81.2 33.95,81.45 U1.2
BUZZ  (via drill 0.35)
  Top 0.254: v28.2,51.8 v14.9,51.8
  Bottom 0.254: R7.1 31,52.8 30,51.8 v28.2,51.8 | v14.9,51.8 14.3,51.8 10.7,55.4 10.7,63.5 11.3,64.1 11.3,72.7 17.05,78.45 U1.29
COM  (via drill 0.35)  (1 unrouted)
  Top 1.27: P1.P$1 14.2,9 20.1,14.9 24.9,14.9 28.4,18.4 28.4,27 31.4,30 v32,30 v34,30
  Bottom 0.508: P1.P$1 9,15 | 9,15 9,15.35 IC3.4 | 9,15 6.75,15 IC2.4
  Bottom 1.27: R9.2 v34,30 31.4,30
  other vias: 33,30
GND  (via drill 0.35)
  Top 0.254: C29.2 7.6,62.3 v6.1,63.8
  Top 0.508: S5.3 49.6,58.08 C26.2 49.6,65 | C28.2 21.6,58.08 S3.3 22.18,55.3 v34.4,55.3 34.5,55.4 S4.3 35.6,58.08 C27.2 35.6,60.5 v34.2,61.9 | S2.3 7.6,58.08 C29.2 | 19.42,95.2 23.2,95.2 23.71,95.71 D1.CE | v32.4,72.4 32.4,73.7 34.5,75.8 34.7,75.8
  Bottom 0.254: C13.2 39.3,93.4 C12.2 | U1.47 30.63,87.43 C2.2 | R3.2 6.36,66.06 | v6.1,63.8 6.1,65.8 6.36,66.06 | PT1.P$2 42,80.14 | U2.1 U2.2 | U2.2 U2.3 U2.4 v7.71,89 v7.7,89 | U2.7 U2.2 | 6.36,66.06 v5.1,67.32
  Bottom 0.508: C2.2 C1.2 33.6,93.4 39.3,93.4 | C12.2 38.95,93.45 | PWR.1 58,85.2 C9.2 C10.2 54.45,81.85 IC1.1 | C5.2 40.53,80.14 42,80.14 43.87,80.14 | 43.87,80.14 43.87,80.86 v44,81 | v47,72 R5.2 44.02,70.42 C14.2 v44,72 v47,72 | v34.2,61.9 32.4,63.7 C3.2 v32.4,72.4 | Q2.2 34.05,46.05 34.6,46.6 34.6,55.1 v34.4,55.3 | C13.2 v43.6,93.4 | 43.87,80.14 46.27,80.14 C11.2 | v47,72 v50.2,72
  pour Top (isolate 0.406, rank 2): 60,100 60,64 45,64 30,79 18,79 0,61 0,100
ISEL  (via drill 0.35)
  Top 0.254: v31.9,34.4 28.5,34.4 v27.4,35.5
  Bottom 0.254: IC4.6 36.05,25.35 36.3,25.6 39.8,25.6 43,28.8 43,31.9 40.5,34.4 v31.9,34.4 | U1.20 27.63,73.27 27.9,73 27.9,57 26.7,55.8 26.7,50.2 27.9,49 27.9,36 v27.4,35.5
LCD_CLK  (via drill 0.35)
  Top 0.254: D1.CLK 29.34,95.36 28.6,95.36 28.36,95.36 26.55,95.36 v26.2,95
  Bottom 0.254: v26.2,95 26.63,94.57 U1.39
LCD_DC
  Bottom 0.254: U1.40 27.13,96.46 D1.DC
LCD_DIN
  Bottom 0.254: U1.41 27.63,93.23 28.8,94.4 D1.DIN
LCD_RST
  Bottom 0.254: D1.RST 23.21,95.3 24.3,95.3 26.13,93.47 U1.38
LEDG  (via drill 0.35)
  Top 0.254: v28.6,85.9 28.9,85.9 29.6,85.2 29.6,82.7 27.3,80.4 9.8,80.4 8.1,78.7 4.69,78.7 LED1.3
  Bottom 0.254: U1.42 28.13,85.43 v28.6,85.9
LEDR  (via drill 0.35)
  Top 0.254: v28.9,84.8 28.9,83 26.9,81 12.5,81 v11,82.5
  Bottom 0.254: U1.43 28.63,84.53 v28.9,84.8 | v11,82.5 8.8,82.5 LED1.1
N$1
  Bottom 0.508: P2.P$1 23,11.6 C18.1 30.98,16.6 R12.1
N$2
  Bottom 0.254: U1.5 34.15,79.95 38.6,84.4 Q1.1 39,87.17 C12.1
N$3
  Bottom 0.508: R11.2 24.98,16.6 C17.1 20.6,18 14.9,18 13.95,18.95 IC3.1
N$4
  Bottom 0.508: R13.2 18.98,16.6 C20.1 13.74,16.6 IC3.3
N$5  (via drill 0.35)
  Top 0.254: v16.6,22.4 16.3,22.7 8.5,22.7 7.1,24.1 v1.8,24.1
  Bottom 0.254: C18.2 27.7,19.4 25.9,21.2 23.5,21.2 D4.A 21.7,22.7 20.2,21.2 17.6,21.2 16.8,22 16.8,22.2 v16.6,22.4 | v1.8,24.1 1.2,24.7 1.2,27.9 2.35,29.05 IC7.4
  Bottom 0.508: R12.2 28.02,19.42 C18.2
N$7
  Bottom 0.508: IC4.3 38.42,27.76 R9.1
  Bottom 1.27: R9.1 R10.2
N$8  (via drill 0.35)
  Top 0.254: v24,69.5 24,72.2 v28.8,77
  Bottom 0.254: U1.24 25.63,71.23 C7.1 24,69.6 v24,69.5 | C8.1 34.65,77.95 U1.9 29.75,77.95 v28.8,77
  Bottom 0.508: C4.1 C7.1 | C6.1 C8.1 38,71.75 FB1.2
N$9  (via drill 0.35)
  Top 0.254: v13.5,23.5 8.9,23.5 v8.1,24.3
  Bottom 0.254: IC7.3 6.65,29.05 | 6.65,29.05 7.1,29.5 7.1,33.24 IC8.3 | C20.2 16,22 14.5,23.5 v13.5,23.5 | v8.1,24.3 8.1,27.6 6.65,29.05
  Bottom 0.508: R11.1 22.02,19.42 C17.2 19.02,19.4 R13.1 16.02,19.42 C20.2
N$10  (via drill 0.35)
  Top 0.508: v41.8,31.6 v44.3,31.6
  Bottom 0.508: IC4.1 36.05,28.15 36.3,28.4 36.6,28.4 37,28.8 37,31.3 37.5,31.8 41.6,31.8 v41.8,31.6 | v44.3,31.6 44.42,31.48 R10.1
  Bottom 1.27: F1.2A 57.16,25.74 D3.A D2.C 47.12,27.3 R10.1
N$12  (via drill 0.35)
  Top 0.254: v3.1,32 10.14,32 v13.5,28.64
  Bottom 0.254: IC8.4 3.1,34.65 v3.1,32 | IC9.5 13.9,28.24 v13.5,28.64
N$13
  Bottom 0.254: IC7.1 4.3,31.94 4.3,36.6 4.7,37 4.75,36.95 IC8.1 2.58,39.66 R14.2
N$14  (via drill 0.35)
  Top 0.508: PWR.4 56.72,92.92 55.8,92 55.8,86.3 v55.5,86
  Bottom 0.508: SW1.P$2 58,74.3 C9.1 56.7,80.9 IC1.3 49.5,81.7 51.1,83.3 52.8,83.3 v55.5,86
N$15
  Bottom 0.254: LED1.2 3.68,83.17 R6.2
N$17
  Bottom 0.508: R19.2 R20.1 12.63,34.06 IC9.3
N$18
  Bottom 0.406: IC5.4 35.35,21.05 38,23.7 37.95,23.75 IC4.4
N$19
  Bottom 0.508: SG1.+ 24.98,35.73 R8.1
N$21
  Bottom 0.254: U1.6 34.45,79.45 41.77,86.77 42,86.77 | 42,86.77 Q1.2 | 42,86.77 C13.1
N$22
  Top 2.54: P3.P$1 37,17.54 F1.1A
N$36
  Bottom 0.508: Q2.3 30.8,38.71 SG1.-
N$37
  Bottom 0.508: Q2.1 31,50.15 R7.2
NRST  (via drill 0.35)
  Top 0.254: v48.1,90.3 v48.1,92.7 | v29.3,93.4 v24.9,93.4
  Bottom 0.254: U1.7 36.55,78.95 C5.1 37.6,81.7 40,84.1 45,84.1 48.1,87.2 v48.1,90.3 | v48.1,92.7 45.8,95 30.9,95 v29.3,93.4 | v24.9,93.4 24.4,93.9 9.5,93.9 7.76,92.16 EXP.7
OFSEL  (via drill 0.35)
  Top 0.254: v7,27.5 8,28.5 v8,29
  Bottom 0.254: U1.33 22.65,80.45 22.2,80.9 14.6,80.9 10.7,77 10.7,65 4.85,59.15 4.85,58.65 8,55.5 v8,29 | IC2.6 5.65,18.95 6.7,20 6.7,27.2 v7,27.5
RX
  Bottom 0.254: PWR.3 56.28,92 38.1,92 37.3,91.2 37.3,88.1 31.4,82.2 29.8,82.2 27.05,79.45 U1.31
SCL  (via drill 0.35)
  Top 0.254: EXP.3 20.12,89.8 v20.6,89.8 28.1,89.8 v28.4,89.5
  Bottom 0.254: U1.45 29.63,88.27 v28.4,89.5 | U2.6 17.24,87.73 R1.2 20.6,87.22 v20.6,89.8
SDA  (via drill 0.35)
  Top 0.254: EXP.2 21.96,90.5 v28.8,90.5
  Bottom 0.254: v28.8,90.5 30.13,89.17 30.13,89.03 30.12,89.02 30.12,86.98 30.13,86.97 U1.46 | U2.5 18.57,89 R2.2 19.18,90.72 EXP.2
SWCLK  (via drill 0.35)
  Top 0.254: v16.4,84.7 12.6,88.5 v11.8,88.5
  Bottom 0.254: U1.37 17.15,83.45 16.4,84.2 v16.4,84.7 | v11.8,88.5 10.3,90 EXP.6
SWDIO  (via drill 0.35)
  Top 0.254: v12.8,84.5 v12.8,87.4
  Bottom 0.254: U1.34 25.25,80.95 25.5,81.2 25.5,82.1 24.9,82.7 14.5,82.7 12.8,84.4 v12.8,84.5 | v12.8,87.4 12.8,91.96 EXP.5
TP1A  (via drill 0.35)
  Top 0.254: v43.6,51.3 v43.6,56.3 | v41.4,40 41.36,39.96 TP.7
  Top 0.508: TP.5 46.44,36.79 TP.6 43.9,35.01 TP.7 41.36,36.79 TP.8 38.82,36.82 TPCON.2
  Bottom 0.254: U1.12 33.45,76.45 35.2,74.7 35.2,70.1 43.6,61.7 v43.6,56.3 | R23.2 R21.2 R25.1 | R23.2 43.6,49.38 v43.6,51.3 | v41.4,40 41.8,40.4 R23.2
TP1H  (via drill 0.35)
  Top 0.254: v13.7,53.8 14.8,52.7 v29.2,52.7
  Bottom 0.254: U1.27 16.95,77.45 11.9,72.4 11.9,63.1 11.3,62.5 11.3,56.7 13.5,54.5 13.5,54 v13.7,53.8 | R25.2 36.4,54.6 34.9,56.1 31.3,56.1 29.2,54 v29.2,52.7
TP1L  (via drill 0.35)
  Top 0.254: v14.9,54.2 15.6,53.5 v28.4,53.5
  Bottom 0.254: U1.26 17.25,76.95 12.5,72.2 12.5,62.6 11.9,62 11.9,57.2 v14.9,54.2 | R21.1 39,53 35.4,56.6 30.9,56.6 28.4,54.1 v28.4,53.5
TP1M
  Bottom 0.254: R23.1 41.8,51.4 30.7,62.5 30.7,72.2 29.6,73.3 29.63,73.33 U1.16
TP2A  (via drill 0.35)  (1 unrouted)
  Top 0.254: v44.6,49.1 44.6,54.9 v44.8,55.1 | 51.5,38.08 TP.3
  Top 0.508: TP.2 56.6,36.79 | TP.1 56.6,37.4 56.4,37.2 | P4.P$1 55.1,13.1 55.1,32.58 TP.2 | TP.4 51.5,36.26 | TP.2 53.93,33.83 51.5,36.26 | 51.5,36.26 51.52,36.28 TP.3 51.52,40.08 v51.5,40.1
  Bottom 0.254: U1.11 33.85,76.95 35.8,75 35.8,70.4 44.8,61.4 v44.8,55.1 | v44.6,49.1 44.6,48.98 R22.2 R24.2 R26.1 51,46.58 51,40.6 v51.5,40.1
  Bottom 0.508: TPCON.1 49,37.6 v51.5,40.1
TP2H
  Bottom 0.254: U1.13 32.15,74.95 34.6,72.5 34.6,63.8 45.8,52.6 49.82,52.6 R26.2
TP2L
  Bottom 0.254: R22.1 44.12,52.3 41.8,52.3 31.3,62.8 31.3,72.7 30.13,73.87 U1.15
TP2M
  Bottom 0.254: R24.1 47.52,51.9 45.6,51.9 33.4,64.1 33.4,69.2 33.9,69.7 33.9,72.3 32.7,73.5 31.29,73.5 30.63,74.16 U1.14
TX  (via drill 0.35)
  Top 0.254: v30.2,81.2 39.1,90.1 v43.9,90.1
  Bottom 0.254: PWR.2 54.54,91.2 45.6,91.2 44.5,90.1 v43.9,90.1 | U1.30 27.95,78.95 v30.2,81.2
V_BATT
  Bottom 0.254: SW1.P$1 57.7,70 57.7,68 56.9,67.2 54.3,67.2 51.08,70.42 R4.1
VREF  (via drill 0.35)
  Top 0.254: v21.3,66 21.3,69.5 v20.7,70.1
  Bottom 0.254: C22.1 21.85,76.45 U1.25 | R19.1 16.42,56.62 21.3,61.5 v21.3,66 | v20.7,70.1 19.91,70.89 IC6.8
  Bottom 0.508: IC6.7 IC6.8 20.4,72.11 C22.1
VREF/2  (via drill 0.35)
  Top 0.254: v19.5,61.2 v22.4,64.1 | v8.3,21.8 8.8,21.3 26.3,21.3 v26.8,21.8
  Bottom 0.254: U1.19 28.13,76.27 27.9,76.5 26.8,76.5 26.63,76.33 U1.22 26.6,74.92 26.6,72.5 26.9,72.2 26.9,67 26.2,66.3 24.6,66.3 v22.4,64.1 | IC9.2 11.37,38.97 12.4,40 14.5,40 15.7,41.2 15.7,57.4 17.75,59.45 | 17.75,59.45 v19.5,61.2 | IC2.3 8,17.05 8.3,17.35 8.3,20.8 | IC5.5 34,20.5 33.6,20.1 32.7,20.1 31,21.8 v26.8,21.8 | C24.1 17.2,60 17.75,59.45 | 8.3,20.8 8.9,21.4 8.9,27.7 10.1,28.89 IC9.1 | v8.3,21.8 8.3,20.8
  Bottom 0.406: IC5.5 34,21.6 33.35,22.25 IC5.1
  Bottom 0.508: IC9.2 IC9.1
VSEL0  (via drill 0.35)
  Top 0.254: v9.5,19.7 8.8,19.7 v7.7,20.8 | v7.4,26.5 9,28.1 v9,29.1 | v5.8,58.9 5.8,61.1 v5.85,61.15
  Bottom 0.254: U1.35 14.15,81.45 9.9,77.2 9.9,65.2 v5.85,61.15 | IC3.6 9.95,19.7 v9.5,19.7 | v7.7,20.8 7.4,21.1 v7.4,26.5 | v5.8,58.9 9,55.7 v9,29.1
VSEL1
  Bottom 0.254: U1.36 13.75,81.95 9.3,77.5 9.3,65.4 6.6,62.7 6,62.7 4,60.7 4,43.7 2.2,41.9 2.15,41.85 1.1,40.8 1.1,38.55 IC8.6 2.45,36.95 1.6,36.1 1.6,32.05 IC7.6

### Text on the board
tPlace: VIN | RX | RST | SCL | SDA | GND | +3V | TX | SWCLK | SWDIO | GND | OFF | BOOT0 | ON | RANGE | HOLD | TP1 | MODE | DC/RMS | TP2 | COM | VOLT | AMP | TEST | STM32 DMM rev. 1.5 martin@embedblog.eu 08/19
bPlace: 2.5 A QUICK